# Altium schematic sheet верхняя плата версия 1.SchDoc
size A2; SheetNumber: 1; SheetTotal: 1
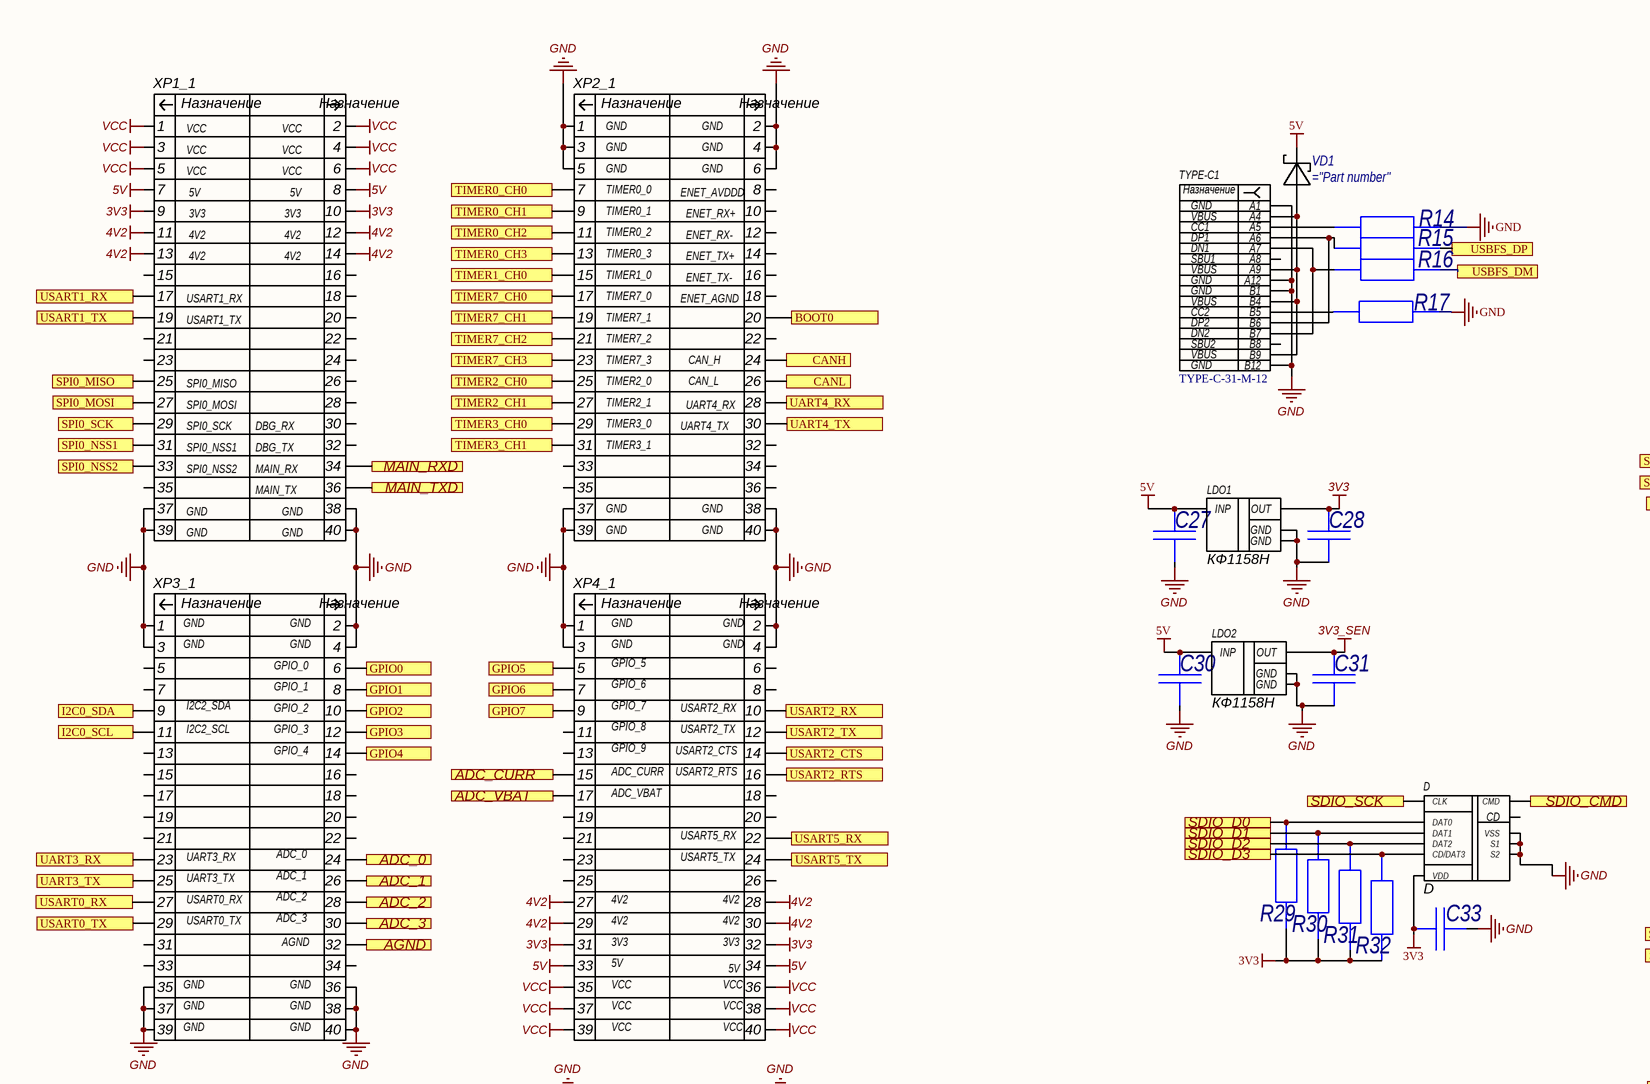
[diagram p0: верхняя плата версия 1.SchDoc, top left]
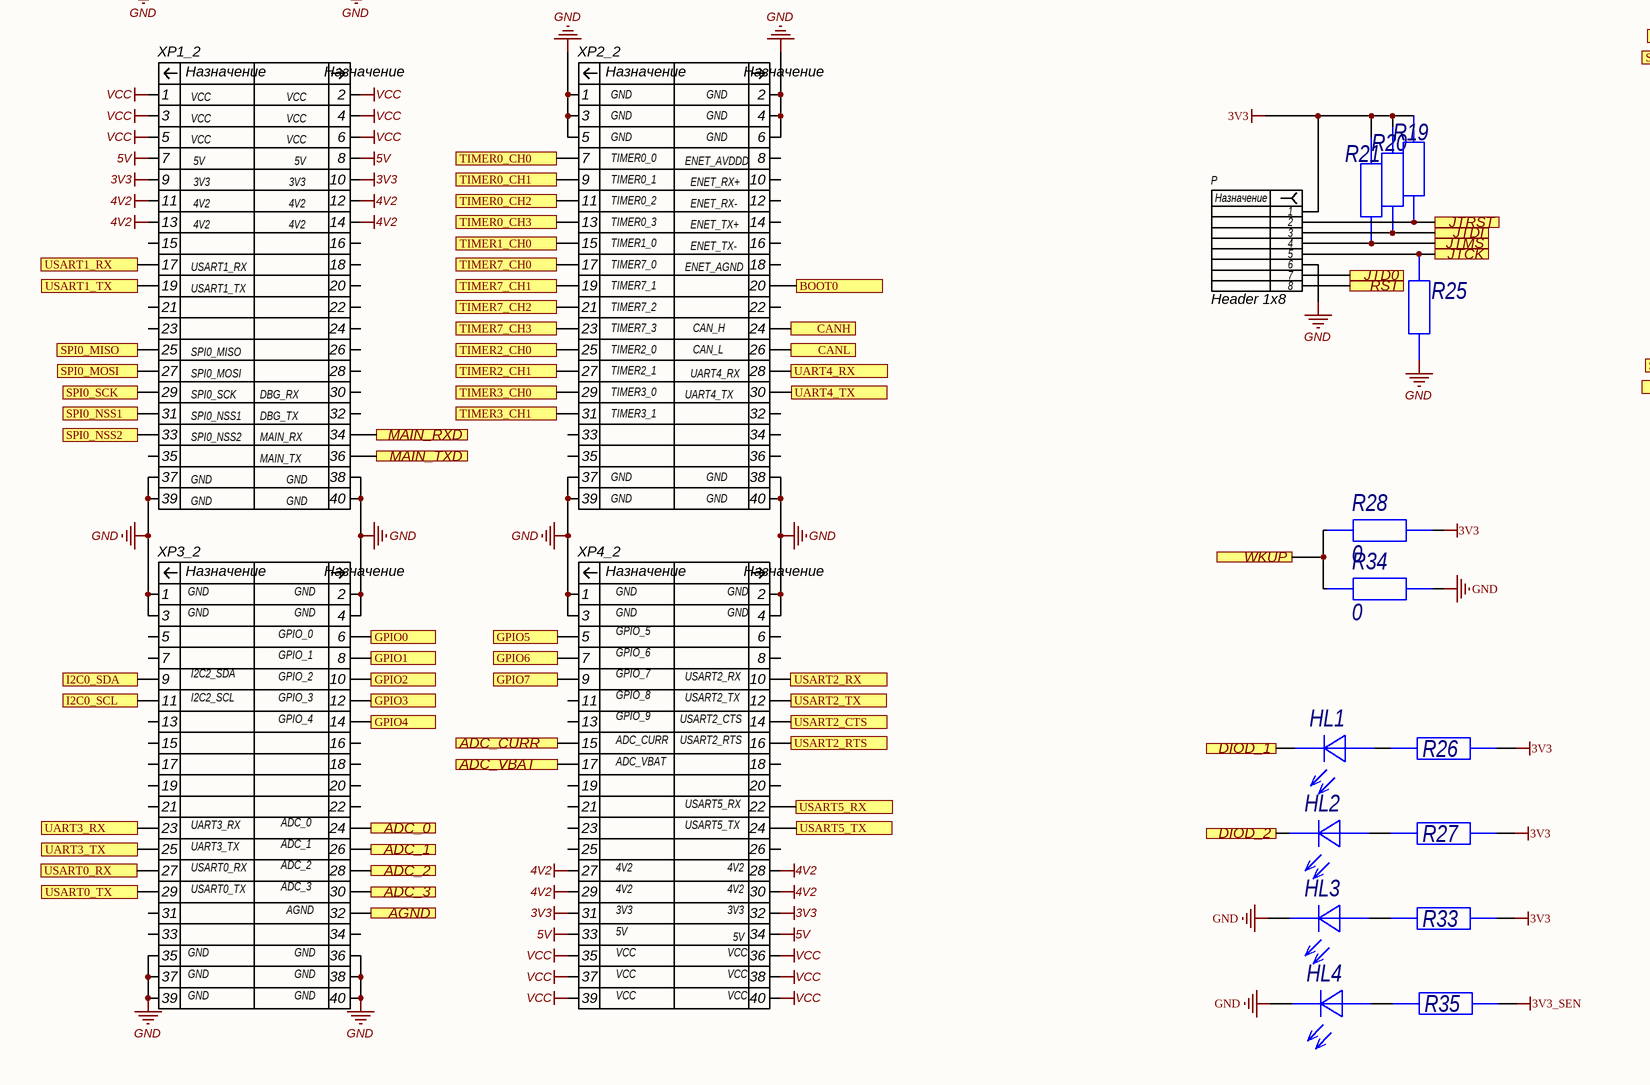
[diagram p1: верхняя плата версия 1.SchDoc, bottom left]
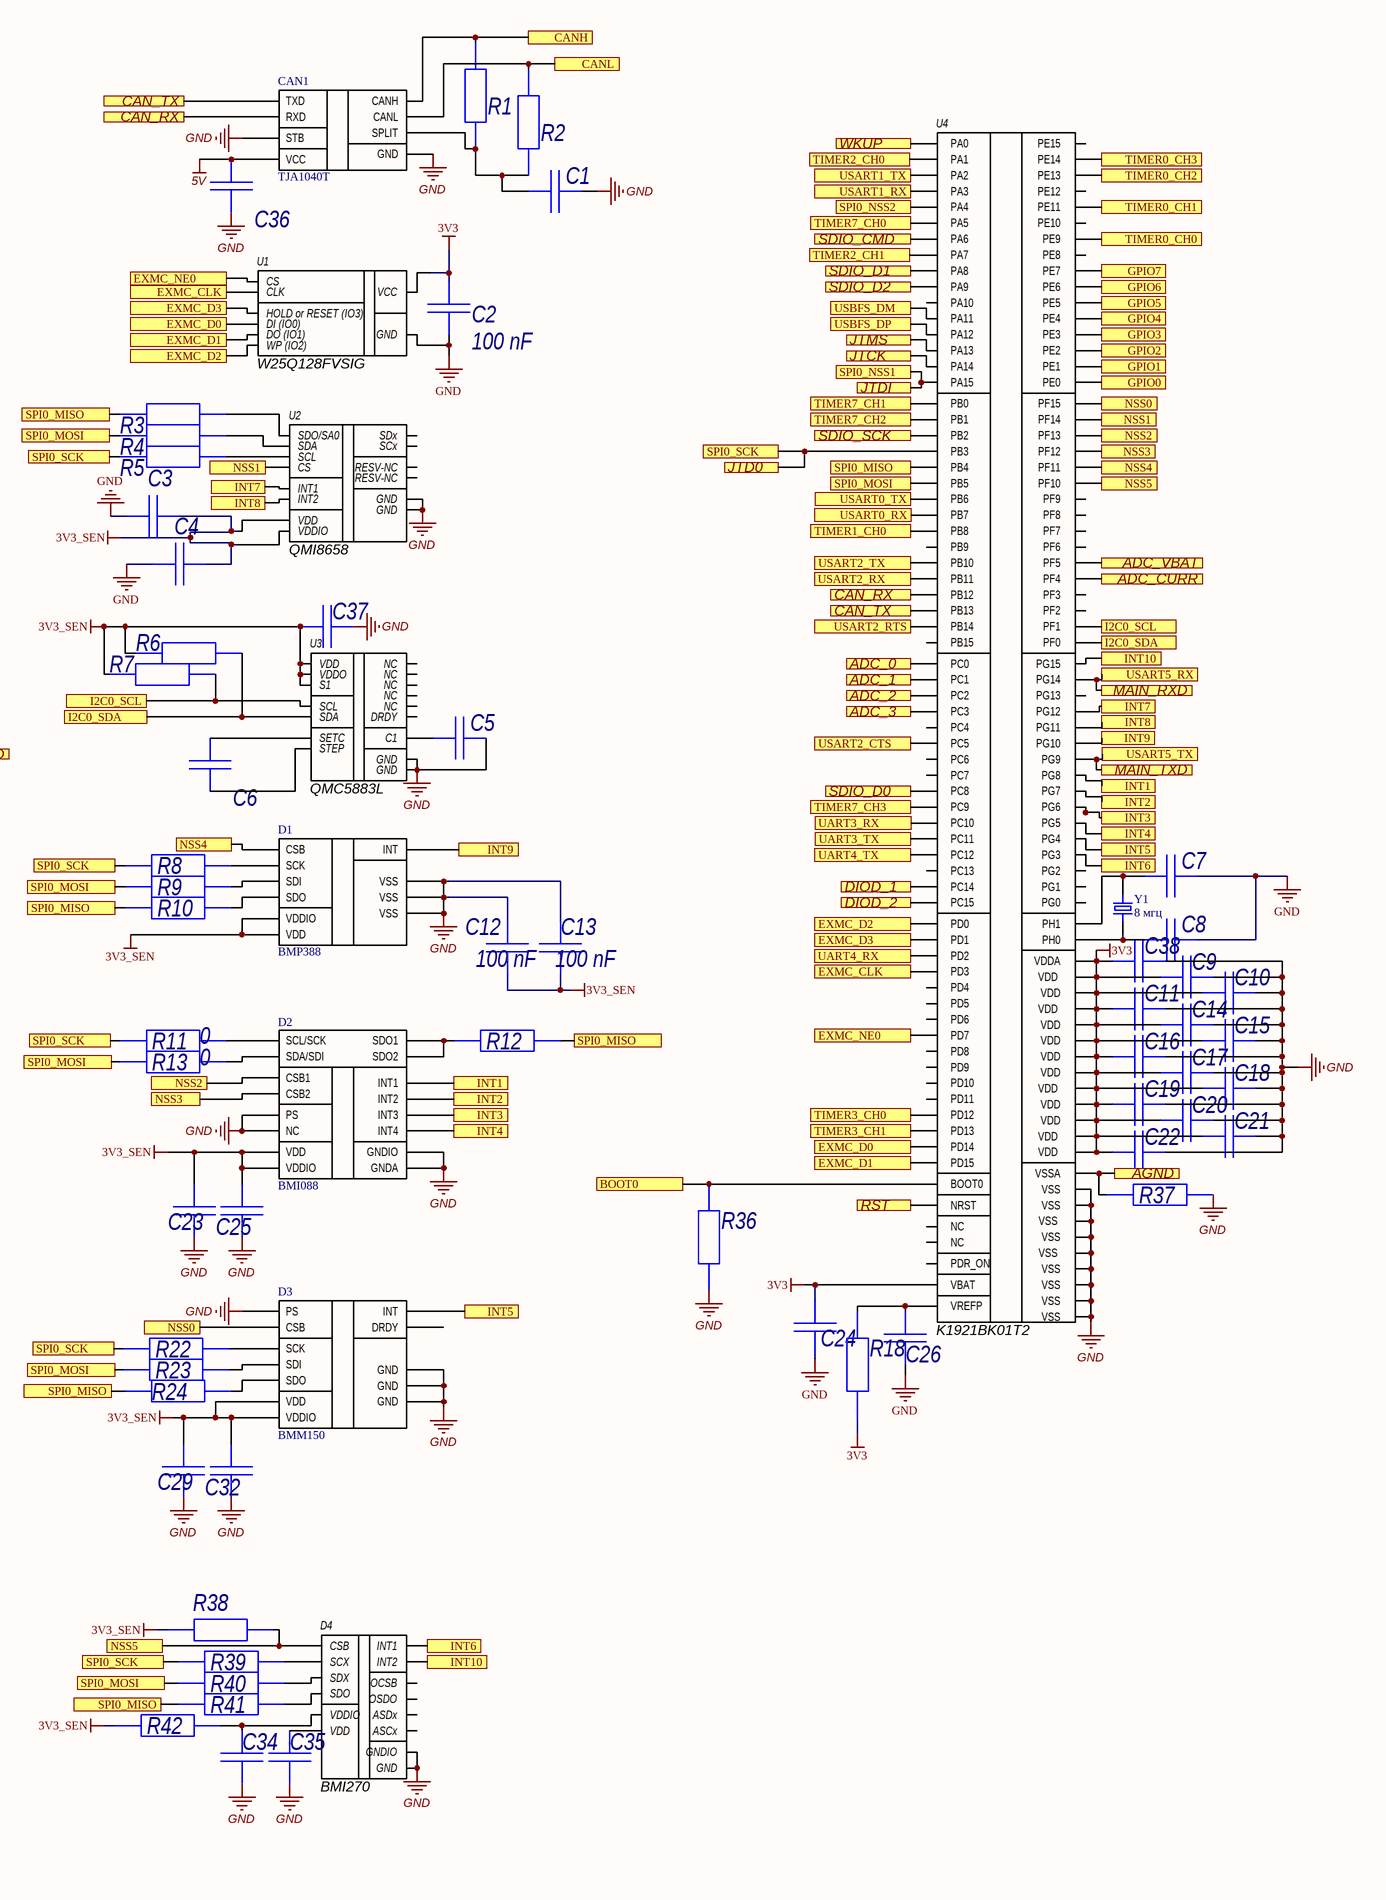
[diagram p2: верхняя плата версия 1.SchDoc, bottom right]

## Parts
C1  47 nF  [C0603]  (value not drawn)
C2  100 nF  [C0603]
C3  100 nF  [C0603]  (value not drawn)
C4  100 nF  [C0603]  (value not drawn)
C5  4.7 uF  [C0603]  (value not drawn)
C6  0.22 uF  [C0603]  (value not drawn)
C7  22 pF  [C0603]  (value not drawn)
C8  22 pF  [C0603]  (value not drawn)
C9  100 nF  [C0603]  (value not drawn)
C10  100 nF  [C0603]  (value not drawn)
C11  100 nF  [C0603]  (value not drawn)
C12  100 nF  [C0603]
C13  100 nF  [C0603]
C14  100 nF  [C0603]  (value not drawn)
C15  100 nF  [C0603]  (value not drawn)
C16  100 nF  [C0603]  (value not drawn)
C17  100 nF  [C0603]  (value not drawn)
C18  100 nF  [C0603]  (value not drawn)
C19  100 nF  [C0603]  (value not drawn)
C20  100 nF  [C0603]  (value not drawn)
C21  100 nF  [C0603]  (value not drawn)
C22  100 nF  [C0603]  (value not drawn)
C23  100 nF  [C0603]  (value not drawn)
C24  100 nF  [C0603]  (value not drawn)
C25  100 nF  [C0603]  (value not drawn)
C26  100 nF  [C0603]  (value not drawn)
C27  0.1 uF  [C0603]  (value not drawn)
C28  10 uF  [C0603]  (value not drawn)
C29  100 nF  [C0603]  (value not drawn)
C30  0.1 uF  [C0603]  (value not drawn)
C31  10 uF  [C0603]  (value not drawn)
C32  100 nF  [C0603]  (value not drawn)
C33  0.1 uF  [C0603]  (value not drawn)
C34  100 nF  [C0603]  (value not drawn)
C35  100 nF  [C0603]  (value not drawn)
C36  100 nF  [C0603]  (value not drawn)
C37  100 nF  [C0603]  (value not drawn)
C38  100 nF  [C0603]  (value not drawn)
CAN1  TJA1040T  [SO-8_S]
D  D  [GTFP08131Y2HR]
D1  BMP388  [PQFN50P200X200X80-10N]
D2  BMI088  [PQFN50P450X300X100-16N]
D3  BMM150  [XDCR_BMM150]
D4  BMI270  [XDCR_BMI270]
HL1  (no value)  [LD0805]
HL2  (no value)  [LD0805]
HL3  (no value)  [LD0805]
HL4  (no value)  [LD0805]
LDO1  КФ1158Н  [ТО-263]
LDO2  КФ1158Н  [ТО-263]
P  Header 1x8  [PicoBlade 8pin]
R1  60Om  [R0603]  (value not drawn)
R2  60 Om  [R0603]  (value not drawn)
R3  0  [R0603]  (value not drawn)
R4  0  [R0603]  (value not drawn)
R5  0  [R0603]  (value not drawn)
R6  2.2k  [R0603]  (value not drawn)
R7  2.2k  [R0603]  (value not drawn)
R8  0  [R0603]  (value not drawn)
R9  0  [R0603]  (value not drawn)
R10  0  [R0603]  (value not drawn)
R11  0  [R0603]
R12  0  [R0603]  (value not drawn)
R13  0  [R0603]
R14  5,1 кОм  [R0603]  (value not drawn)
R15  68  [R0603]  (value not drawn)
R16  68  [R0603]  (value not drawn)
R17  5,1 кОм  [R0603]  (value not drawn)
R18  47 Ом  [R0603]  (value not drawn)
R19  47 кОм  [R0603]  (value not drawn)
R20  47 кОм  [R0603]  (value not drawn)
R21  47 кОм  [R0603]  (value not drawn)
R22  0  [R0603]  (value not drawn)
R23  0  [R0603]  (value not drawn)
R24  0  [R0603]  (value not drawn)
R25  47 кОм  [R0603]  (value not drawn)
R26  220  [R0603]  (value not drawn)
R27  220  [R0603]  (value not drawn)
R28  0  [R0603]
R29  47 кОм  [R0603]  (value not drawn)
R30  47 кОм  [R0603]  (value not drawn)
R31  47 кОм  [R0603]  (value not drawn)
R32  47 кОм  [R0603]  (value not drawn)
R33  220  [R0603]  (value not drawn)
R34  0  [R0603]
R35  220  [R0603]  (value not drawn)
R36  10 kOm  [R0603]  (value not drawn)
R37  0  [R0603]  (value not drawn)
R38  10 кОм  [R0603]  (value not drawn)
R39  0  [R0603]  (value not drawn)
R40  0  [R0603]  (value not drawn)
R41  0  [R0603]  (value not drawn)
R42  0  [R0603]  (value not drawn)
TYPE-C1  TYPE-C-31-M-12  [HRO_TYPE-C-31-M-12]
U1  W25Q128FVSIG  [SOIC127P790X216-8N]
U2  QMI8658  [QMI8658]
U3  QMC5883L  [QMC5883L]
U4  K1921BK01T2  [QFP50P2200X2200X160-144N]
VD1  (no value)  [DO-214AA]
XP1_1  PLLD-1.27-40S  [Headr 2x20 male]  (value not drawn)
XP1_2  PLLD-1.27-40S  [Headr 2x20 Female]  (value not drawn)
XP2_1  PLLD-1.27-40S  [Headr 2x20 male]  (value not drawn)
XP2_2  PLLD-1.27-40S  [Headr 2x20 Female]  (value not drawn)
XP3_1  PLLD-1.27-40S  [Headr 2x20 male]  (value not drawn)
XP3_2  PLLD-1.27-40S  [Headr 2x20 Female]  (value not drawn)
XP4_1  PLLD-1.27-40S  [Headr 2x20 male]  (value not drawn)
XP4_2  PLLD-1.27-40S  [Headr 2x20 Female]  (value not drawn)
Y1  8 мгц  [XTAL_ABM7-8.000MHZ-8-R80-D2Y-T]

## Ports
ADC_0 (see верхняя плата версия 1[2B], верхняя плата версия 1[2D]), ADC_0 (see верхняя плата версия 1[2B], верхняя плата версия 1[7B]), ADC_0 (see верхняя плата версия 1[2D], верхняя плата версия 1[7B]), ADC_1 (see верхняя плата версия 1[2B], верхняя плата версия 1[2D]), ADC_1 (see верхняя плата версия 1[2B], верхняя плата версия 1[7B]), ADC_1 (see верхняя плата версия 1[2D], верхняя плата версия 1[7B]), ADC_2 (see верхняя плата версия 1[2B], верхняя плата версия 1[2D]), ADC_2 (see верхняя плата версия 1[2B], верхняя плата версия 1[7B]), ADC_2 (see верхняя плата версия 1[2D], верхняя плата версия 1[7B]), ADC_3 (see верхняя плата версия 1[2B], верхняя плата версия 1[2D]), ADC_3 (see верхняя плата версия 1[2B], верхняя плата версия 1[7B]), ADC_3 (see верхняя плата версия 1[2D], верхняя плата версия 1[7B]), ADC_CURR (see верхняя плата версия 1[2B], верхняя плата версия 1[2D]), ADC_CURR (see верхняя плата версия 1[2B], верхняя плата версия 1[8B]), ADC_CURR (see верхняя плата версия 1[2D], верхняя плата версия 1[8B]), ADC_VBAT (see верхняя плата версия 1[2B], верхняя плата версия 1[2D]), ADC_VBAT (see верхняя плата версия 1[2B], верхняя плата версия 1[8B]), ADC_VBAT (see верхняя плата версия 1[2D], верхняя плата версия 1[8B]), AGND (see верхняя плата версия 1[2B], верхняя плата версия 1[2D]), AGND (see верхняя плата версия 1[2B], верхняя плата версия 1[8C]), AGND (see верхняя плата версия 1[2D], верхняя плата версия 1[8C]), BOOT0 (see верхняя плата версия 1[3A], верхняя плата версия 1[3C]), BOOT0 (see верхняя плата версия 1[3A], верхняя плата версия 1[6C]), BOOT0 (see верхняя плата версия 1[3C], верхняя плата версия 1[6C]), CAN_RX (see верхняя плата версия 1[5A]), CAN_RX (see верхняя плата версия 1[7B]), CAN_TX (see верхняя плата версия 1[5A]), CAN_TX (see верхняя плата версия 1[7B]), CANH (see верхняя плата версия 1[3A], верхняя плата версия 1[3C]), CANH (see верхняя плата версия 1[3A], верхняя плата версия 1[6A]), CANH (see верхняя плата версия 1[3C], верхняя плата версия 1[6A]), CANL (see верхняя плата версия 1[3A], верхняя плата версия 1[3C]), CANL (see верхняя плата версия 1[3A], верхняя плата версия 1[6A]), CANL (see верхняя плата версия 1[3C], верхняя плата версия 1[6A]), DIOD_1 (see верхняя плата версия 1[4D]), DIOD_1 (see верхняя плата версия 1[7B]), DIOD_2 (see верхняя плата версия 1[4D]), DIOD_2 (see верхняя плата версия 1[7B]), EXMC_CLK (see верхняя плата версия 1[5A]), EXMC_CLK (see верхняя плата версия 1[7B]), EXMC_D0 (see верхняя плата версия 1[5A]), EXMC_D0 (see верхняя плата версия 1[7C]), EXMC_D1 (see верхняя плата версия 1[5A]), EXMC_D1 (see верхняя плата версия 1[7C]), EXMC_D2 (see верхняя плата версия 1[5A]), EXMC_D2 (see верхняя плата версия 1[7B]), EXMC_D3 (see верхняя плата версия 1[5A]), EXMC_D3 (see верхняя плата версия 1[7B]), EXMC_NE0 (see верхняя плата версия 1[5A]), EXMC_NE0 (see верхняя плата версия 1[7B]), GPIO0 (see верхняя плата версия 1[2B], верхняя плата версия 1[2D]), GPIO0 (see верхняя плата версия 1[2B], верхняя плата версия 1[8A]), GPIO0 (see верхняя плата версия 1[2D], верхняя плата версия 1[8A]), GPIO1 (see верхняя плата версия 1[2B], верхняя плата версия 1[2D]), GPIO1 (see верхняя плата версия 1[2B], верхняя плата версия 1[8A]), GPIO1 (see верхняя плата версия 1[2D], верхняя плата версия 1[8A]), GPIO2 (see верхняя плата версия 1[2B], верхняя плата версия 1[2D]), GPIO2 (see верхняя плата версия 1[2B], верхняя плата версия 1[8A]), GPIO2 (see верхняя плата версия 1[2D], верхняя плата версия 1[8A]), GPIO3 (see верхняя плата версия 1[2B], верхняя плата версия 1[2D]), GPIO3 (see верхняя плата версия 1[2B], верхняя плата версия 1[8A]), GPIO3 (see верхняя плата версия 1[2D], верхняя плата версия 1[8A]), GPIO4 (see верхняя плата версия 1[2B], верхняя плата версия 1[2D]), GPIO4 (see верхняя плата версия 1[2B], верхняя плата версия 1[8A]), GPIO4 (see верхняя плата версия 1[2D], верхняя плата версия 1[8A]), GPIO5 (see верхняя плата версия 1[2B], верхняя плата версия 1[2D]), GPIO5 (see верхняя плата версия 1[2B], верхняя плата версия 1[8A]), GPIO5 (see верхняя плата версия 1[2D], верхняя плата версия 1[8A]), GPIO6 (see верхняя плата версия 1[2B], верхняя плата версия 1[2D]), GPIO6 (see верхняя плата версия 1[2B], верхняя плата версия 1[8A]), GPIO6 (see верхняя плата версия 1[2D], верхняя плата версия 1[8A]), GPIO7 (see верхняя плата версия 1[2B], верхняя плата версия 1[2D]), GPIO7 (see верхняя плата версия 1[2B], верхняя плата версия 1[8A]), GPIO7 (see верхняя плата версия 1[2D], верхняя плата версия 1[8A]), I2C0_SCL (see верхняя плата версия 1[1B], верхняя плата версия 1[1D], верхняя плата версия 1[5B]), I2C0_SCL (see верхняя плата версия 1[1B], верхняя плата версия 1[1D], верхняя плата версия 1[8B]), I2C0_SCL (see верхняя плата версия 1[1B], верхняя плата версия 1[5B], верхняя плата версия 1[8B]), I2C0_SCL (see верхняя плата версия 1[1D], верхняя плата версия 1[5B], верхняя плата версия 1[8B]), I2C0_SDA (see верхняя плата версия 1[1B], верхняя плата версия 1[1D], верхняя плата версия 1[5B]), I2C0_SDA (see верхняя плата версия 1[1B], верхняя плата версия 1[1D], верхняя плата версия 1[8B]), I2C0_SDA (see верхняя плата версия 1[1B], верхняя плата версия 1[5B], верхняя плата версия 1[8B]), I2C0_SDA (see верхняя плата версия 1[1D], верхняя плата версия 1[5B], верхняя плата версия 1[8B]), INT1 (see верхняя плата версия 1[6C]), INT1 (see верхняя плата версия 1[8B]), INT2 (see верхняя плата версия 1[6C]), INT2 (see верхняя плата версия 1[8B]), INT3 (see верхняя плата версия 1[6C]), INT3 (see верхняя плата версия 1[8B]), INT4 (see верхняя плата версия 1[6C]), INT4 (see верхняя плата версия 1[8B]), INT5 (see верхняя плата версия 1[6C]), INT5 (see верхняя плата версия 1[8B]), INT6 (see верхняя плата версия 1[6D]), INT6 (see верхняя плата версия 1[8B]), INT7 (see верхняя плата версия 1[5A]), INT7 (see верхняя плата версия 1[8B]), INT8 (see верхняя плата версия 1[5A]), INT8 (see верхняя плата версия 1[8B]), INT9 (see верхняя плата версия 1[6B]), INT9 (see верхняя плата версия 1[8B]), INT10 (see верхняя плата версия 1[6D]), INT10 (see верхняя плата версия 1[8B]), JTCK (see верхняя плата версия 1[4C]), JTCK (see верхняя плата версия 1[7A]), JTD0 (see верхняя плата версия 1[4C]), JTD0 (see верхняя плата версия 1[7A]), JTDI (see верхняя плата версия 1[4C]), JTDI (see верхняя плата версия 1[7A]), JTMS (see верхняя плата версия 1[4C]), JTMS (see верхняя плата версия 1[7A]), JTRST, MAIN_RXD (see верхняя плата версия 1[2A], верхняя плата версия 1[2C]), MAIN_RXD (see верхняя плата версия 1[2A], верхняя плата версия 1[8B]), MAIN_RXD (see верхняя плата версия 1[2C], верхняя плата версия 1[8B]), MAIN_TXD (see верхняя плата версия 1[2A], верхняя плата версия 1[2C]), MAIN_TXD (see верхняя плата версия 1[2A], верхняя плата версия 1[8B]), MAIN_TXD (see верхняя плата версия 1[2C], верхняя плата версия 1[8B]), NSS0 (see верхняя плата версия 1[5C]), NSS0 (see верхняя плата версия 1[8A]), NSS1 (see верхняя плата версия 1[5A]), NSS1 (see верхняя плата версия 1[8A]), NSS2 (see верхняя плата версия 1[5C]), NSS2 (see верхняя плата версия 1[8A]), NSS3 (see верхняя плата версия 1[5C]), NSS3 (see верхняя плата версия 1[8A]), NSS4 (see верхняя плата версия 1[5B]), NSS4 (see верхняя плата версия 1[8A]), NSS5 (see верхняя плата версия 1[5D]), NSS5 (see верхняя плата версия 1[8A]), RST (see верхняя плата версия 1[4C]), RST (see верхняя плата версия 1[7C]), SDIO_CMD (see верхняя плата версия 1[5B]), SDIO_CMD (see верхняя плата версия 1[7A]), SDIO_D0 (see верхняя плата версия 1[4B]), SDIO_D0 (see верхняя плата версия 1[7B]), SDIO_D1 (see верхняя плата версия 1[4B]), SDIO_D1 (see верхняя плата версия 1[7A]), SDIO_D2 (see верхняя плата версия 1[4B]), SDIO_D2 (see верхняя плата версия 1[7A]), SDIO_D3, SDIO_SCK (see верхняя плата версия 1[4B]), SDIO_SCK (see верхняя плата версия 1[7A]), SPI0_MISO (see верхняя плата версия 1[1A], верхняя плата версия 1[1C], верхняя плата версия 1[5A], верхняя плата версия 1[5B], верхняя плата версия 1[5C], верхняя плата версия 1[5D], верхняя плата версия 1[6C]), SPI0_MISO (see верхняя плата версия 1[1A], верхняя плата версия 1[1C], верхняя плата версия 1[5A], верхняя плата версия 1[5B], верхняя плата версия 1[5C], верхняя плата версия 1[5D], верхняя плата версия 1[7A]), SPI0_MISO (see верхняя плата версия 1[1A], верхняя плата версия 1[1C], верхняя плата версия 1[5A], верхняя плата версия 1[5B], верхняя плата версия 1[5C], верхняя плата версия 1[6C], верхняя плата версия 1[7A]), SPI0_MISO (see верхняя плата версия 1[1A], верхняя плата версия 1[1C], верхняя плата версия 1[5A], верхняя плата версия 1[5B], верхняя плата версия 1[5D], верхняя плата версия 1[6C], верхняя плата версия 1[7A]), SPI0_MISO (see верхняя плата версия 1[1A], верхняя плата версия 1[1C], верхняя плата версия 1[5A], верхняя плата версия 1[5C], верхняя плата версия 1[5D], верхняя плата версия 1[6C], верхняя плата версия 1[7A]), SPI0_MISO (see верхняя плата версия 1[1A], верхняя плата версия 1[1C], верхняя плата версия 1[5B], верхняя плата версия 1[5C], верхняя плата версия 1[5D], верхняя плата версия 1[6C], верхняя плата версия 1[7A]), SPI0_MISO (see верхняя плата версия 1[1A], верхняя плата версия 1[5A], верхняя плата версия 1[5B], верхняя плата версия 1[5C], верхняя плата версия 1[5D], верхняя плата версия 1[6C], верхняя плата версия 1[7A]), SPI0_MISO (see верхняя плата версия 1[1C], верхняя плата версия 1[5A], верхняя плата версия 1[5B], верхняя плата версия 1[5C], верхняя плата версия 1[5D], верхняя плата версия 1[6C], верхняя плата версия 1[7A]), SPI0_MOSI (see верхняя плата версия 1[1A], верхняя плата версия 1[1C], верхняя плата версия 1[5A], верхняя плата версия 1[5B], верхняя плата версия 1[5C], верхняя плата версия 1[5D]), SPI0_MOSI (see верхняя плата версия 1[1A], верхняя плата версия 1[1C], верхняя плата версия 1[5A], верхняя плата версия 1[5B], верхняя плата версия 1[5C], верхняя плата версия 1[5D], верхняя плата версия 1[7A]), SPI0_MOSI (see верхняя плата версия 1[1A], верхняя плата версия 1[1C], верхняя плата версия 1[5A], верхняя плата версия 1[5B], верхняя плата версия 1[5C], верхняя плата версия 1[7A]), SPI0_MOSI (see верхняя плата версия 1[1A], верхняя плата версия 1[1C], верхняя плата версия 1[5A], верхняя плата версия 1[5C], верхняя плата версия 1[5D], верхняя плата версия 1[7A]), SPI0_MOSI (see верхняя плата версия 1[1A], верхняя плата версия 1[1C], верхняя плата версия 1[5B], верхняя плата версия 1[5C], верхняя плата версия 1[5D], верхняя плата версия 1[7A]), SPI0_MOSI (see верхняя плата версия 1[1A], верхняя плата версия 1[5A], верхняя плата версия 1[5B], верхняя плата версия 1[5C], верхняя плата версия 1[5D], верхняя плата версия 1[7A]), SPI0_MOSI (see верхняя плата версия 1[1C], верхняя плата версия 1[5A], верхняя плата версия 1[5B], верхняя плата версия 1[5C], верхняя плата версия 1[5D], верхняя плата версия 1[7A]), SPI0_NSS1 (see верхняя плата версия 1[1A], верхняя плата версия 1[1C]), SPI0_NSS1 (see верхняя плата версия 1[1A], верхняя плата версия 1[7A]), SPI0_NSS1 (see верхняя плата версия 1[1C], верхняя плата версия 1[7A]), SPI0_NSS2 (see верхняя плата версия 1[1A], верхняя плата версия 1[1C]), SPI0_NSS2 (see верхняя плата версия 1[1A], верхняя плата версия 1[7A]), SPI0_NSS2 (see верхняя плата версия 1[1C], верхняя плата версия 1[7A]), SPI0_SCK (see верхняя плата версия 1[1A], верхняя плата версия 1[1C], верхняя плата версия 1[5A], верхняя плата версия 1[5B], верхняя плата версия 1[5C], верхняя плата версия 1[5D]), SPI0_SCK (see верхняя плата версия 1[1A], верхняя плата версия 1[1C], верхняя плата версия 1[5A], верхняя плата версия 1[5B], верхняя плата версия 1[5C], верхняя плата версия 1[5D], верхняя плата версия 1[7A]), SPI0_SCK (see верхняя плата версия 1[1A], верхняя плата версия 1[1C], верхняя плата версия 1[5A], верхняя плата версия 1[5B], верхняя плата версия 1[5C], верхняя плата версия 1[7A]), SPI0_SCK (see верхняя плата версия 1[1A], верхняя плата версия 1[1C], верхняя плата версия 1[5A], верхняя плата версия 1[5C], верхняя плата версия 1[5D], верхняя плата версия 1[7A]), SPI0_SCK (see верхняя плата версия 1[1A], верхняя плата версия 1[1C], верхняя плата версия 1[5B], верхняя плата версия 1[5C], верхняя плата версия 1[5D], верхняя плата версия 1[7A]), SPI0_SCK (see верхняя плата версия 1[1A], верхняя плата версия 1[5A], верхняя плата версия 1[5B], верхняя плата версия 1[5C], верхняя плата версия 1[5D], верхняя плата версия 1[7A]), SPI0_SCK (see верхняя плата версия 1[1C], верхняя плата версия 1[5A], верхняя плата версия 1[5B], верхняя плата версия 1[5C], верхняя плата версия 1[5D], верхняя плата версия 1[7A]), TIMER0_CH0 (see верхняя плата версия 1[2A], верхняя плата версия 1[2C]), TIMER0_CH0 (see верхняя плата версия 1[2A], верхняя плата версия 1[8A]), TIMER0_CH0 (see верхняя плата версия 1[2C], верхняя плата версия 1[8A]), TIMER0_CH1 (see верхняя плата версия 1[2A], верхняя плата версия 1[2C]), TIMER0_CH1 (see верхняя плата версия 1[2A], верхняя плата версия 1[8A]), TIMER0_CH1 (see верхняя плата версия 1[2C], верхняя плата версия 1[8A]), TIMER0_CH2 (see верхняя плата версия 1[2A], верхняя плата версия 1[2C]), TIMER0_CH2 (see верхняя плата версия 1[2A], верхняя плата версия 1[8A]), TIMER0_CH2 (see верхняя плата версия 1[2C], верхняя плата версия 1[8A]), TIMER0_CH3 (see верхняя плата версия 1[2A], верхняя плата версия 1[2C]), TIMER0_CH3 (see верхняя плата версия 1[2A], верхняя плата версия 1[8A]), TIMER0_CH3 (see верхняя плата версия 1[2C], верхняя плата версия 1[8A]), TIMER1_CH0 (see верхняя плата версия 1[2A], верхняя плата версия 1[2C]), TIMER1_CH0 (see верхняя плата версия 1[2A], верхняя плата версия 1[7B]), TIMER1_CH0 (see верхняя плата версия 1[2C], верхняя плата версия 1[7B]), TIMER2_CH0 (see верхняя плата версия 1[2A], верхняя плата версия 1[2C]), TIMER2_CH0 (see верхняя плата версия 1[2A], верхняя плата версия 1[7A]), TIMER2_CH0 (see верхняя плата версия 1[2C], верхняя плата версия 1[7A]), TIMER2_CH1 (see верхняя плата версия 1[2A], верхняя плата версия 1[2C]), TIMER2_CH1 (see верхняя плата версия 1[2A], верхняя плата версия 1[7A]), TIMER2_CH1 (see верхняя плата версия 1[2C], верхняя плата версия 1[7A]), TIMER3_CH0 (see верхняя плата версия 1[2A], верхняя плата версия 1[2C]), TIMER3_CH0 (see верхняя плата версия 1[2A], верхняя плата версия 1[7C]), TIMER3_CH0 (see верхняя плата версия 1[2C], верхняя плата версия 1[7C]), TIMER3_CH1 (see верхняя плата версия 1[2A], верхняя плата версия 1[2C]), TIMER3_CH1 (see верхняя плата версия 1[2A], верхняя плата версия 1[7C]), TIMER3_CH1 (see верхняя плата версия 1[2C], верхняя плата версия 1[7C]), TIMER7_CH0 (see верхняя плата версия 1[2A], верхняя плата версия 1[2C]), TIMER7_CH0 (see верхняя плата версия 1[2A], верхняя плата версия 1[7A]), TIMER7_CH0 (see верхняя плата версия 1[2C], верхняя плата версия 1[7A]), TIMER7_CH1 (see верхняя плата версия 1[2A], верхняя плата версия 1[2C]), TIMER7_CH1 (see верхняя плата версия 1[2A], верхняя плата версия 1[7A]), TIMER7_CH1 (see верхняя плата версия 1[2C], верхняя плата версия 1[7A]), TIMER7_CH2 (see верхняя плата версия 1[2A], верхняя плата версия 1[2C]), TIMER7_CH2 (see верхняя плата версия 1[2A], верхняя плата версия 1[7A]), TIMER7_CH2 (see верхняя плата версия 1[2C], верхняя плата версия 1[7A]), TIMER7_CH3 (see верхняя плата версия 1[2A], верхняя плата версия 1[2C]), TIMER7_CH3 (see верхняя плата версия 1[2A], верхняя плата версия 1[7B]), TIMER7_CH3 (see верхняя плата версия 1[2C], верхняя плата версия 1[7B]), UART3_RX (see верхняя плата версия 1[1B], верхняя плата версия 1[1D]), UART3_RX (see верхняя плата версия 1[1B], верхняя плата версия 1[7B]), UART3_RX (see верхняя плата версия 1[1D], верхняя плата версия 1[7B]), UART3_TX (see верхняя плата версия 1[1B], верхняя плата версия 1[1D]), UART3_TX (see верхняя плата версия 1[1B], верхняя плата версия 1[7B]), UART3_TX (see верхняя плата версия 1[1D], верхняя плата версия 1[7B]), UART4_RX (see верхняя плата версия 1[3A], верхняя плата версия 1[3C]), UART4_RX (see верхняя плата версия 1[3A], верхняя плата версия 1[7B]), UART4_RX (see верхняя плата версия 1[3C], верхняя плата версия 1[7B]), UART4_TX (see верхняя плата версия 1[3A], верхняя плата версия 1[3C]), UART4_TX (see верхняя плата версия 1[3A], верхняя плата версия 1[7B]), UART4_TX (see верхняя плата версия 1[3C], верхняя плата версия 1[7B]), USART0_RX (see верхняя плата версия 1[1B], верхняя плата версия 1[1D]), USART0_RX (see верхняя плата версия 1[1B], верхняя плата версия 1[7B]), USART0_RX (see верхняя плата версия 1[1D], верхняя плата версия 1[7B]), USART0_TX (see верхняя плата версия 1[1B], верхняя плата версия 1[1D]), USART0_TX (see верхняя плата версия 1[1B], верхняя плата версия 1[7A]), USART0_TX (see верхняя плата версия 1[1D], верхняя плата версия 1[7A]), USART1_RX (see верхняя плата версия 1[1A], верхняя плата версия 1[1C]), USART1_RX (see верхняя плата версия 1[1A], верхняя плата версия 1[7A]), USART1_RX (see верхняя плата версия 1[1C], верхняя плата версия 1[7A]), USART1_TX (see верхняя плата версия 1[1A], верхняя плата версия 1[1C]), USART1_TX (see верхняя плата версия 1[1A], верхняя плата версия 1[7A]), USART1_TX (see верхняя плата версия 1[1C], верхняя плата версия 1[7A]), USART2_CTS (see верхняя плата версия 1[3B], верхняя плата версия 1[3D]), USART2_CTS (see верхняя плата версия 1[3B], верхняя плата версия 1[7B]), USART2_CTS (see верхняя плата версия 1[3D], верхняя плата версия 1[7B]), USART2_RTS (see верхняя плата версия 1[3B], верхняя плата версия 1[3D]), USART2_RTS (see верхняя плата версия 1[3B], верхняя плата версия 1[7B]), USART2_RTS (see верхняя плата версия 1[3D], верхняя плата версия 1[7B]), USART2_RX (see верхняя плата версия 1[3B], верхняя плата версия 1[3D]), USART2_RX (see верхняя плата версия 1[3B], верхняя плата версия 1[7B]), USART2_RX (see верхняя плата версия 1[3D], верхняя плата версия 1[7B]), USART2_TX (see верхняя плата версия 1[3B], верхняя плата версия 1[3D]), USART2_TX (see верхняя плата версия 1[3B], верхняя плата версия 1[7B]), USART2_TX (see верхняя плата версия 1[3D], верхняя плата версия 1[7B]), USART5_RX (see верхняя плата версия 1[3B], верхняя плата версия 1[3D]), USART5_RX (see верхняя плата версия 1[3B], верхняя плата версия 1[8B]), USART5_RX (see верхняя плата версия 1[3D], верхняя плата версия 1[8B]), USART5_TX (see верхняя плата версия 1[3B], верхняя плата версия 1[3D]), USART5_TX (see верхняя плата версия 1[3B], верхняя плата версия 1[8B]), USART5_TX (see верхняя плата версия 1[3D], верхняя плата версия 1[8B]), USBFS_DM (see верхняя плата версия 1[4A]), USBFS_DM (see верхняя плата версия 1[7A]), USBFS_DP (see верхняя плата версия 1[4A]), USBFS_DP (see верхняя плата версия 1[7A]), WKUP (see верхняя плата версия 1[4C]), WKUP (see верхняя плата версия 1[7A])

## Nets
3V3: C2.2 C9.2 C10.2 C11.2 C14.2 C15.2 C16.2 C17.2 C18.2 C19.2 C20.2 C21.2 C22.2 C24.2 C28.2 C33.2 C38.2 D.4(VDD) LDO1.3(OUT) P.1 R18.1 R19.2 R20.2 R21.2 R26.2 R27.2 R28.2 R29.1 R30.1 R31.1 R32.1 R33.2 U1.8(VCC) U4.6(VBAT) U4.17(VDD) U4.30(VDD) U4.33(VDDA) U4.39(VDD) U4.52(VDD) U4.62(VDD) U4.72(VDD) U4.84(VDD) U4.95(VDD) U4.108(VDD) U4.121(VDD) U4.131(VDD) U4.144(VDD) XP1_1.9 XP1_1.10 XP1_2.9 XP1_2.10 XP4_1.31 XP4_1.32 XP4_2.31 XP4_2.32
3V3_SEN: C3.2 C4.2 C12.2 C13.2 C23.2 C25.2 C29.2 C31.2 C32.2 C37.2 D1.1(VDDIO) D1.10(VDD) D2.3(VDD) D2.11(VDDIO) D3.B2(VDDIO) D3.E5(VDD) LDO2.3(OUT) R6.2 R7.2 R35.2 R38.2 R42.2 U2.5(VDDIO) U2.8(VDD) U3.2(VDD) U3.4(S1) U3.13(VDDO)
4V2: XP1_1.11 XP1_1.12 XP1_1.13 XP1_1.14 XP1_2.11 XP1_2.12 XP1_2.13 XP1_2.14 XP4_1.27 XP4_1.28 XP4_1.29 XP4_1.30 XP4_2.27 XP4_2.28 XP4_2.29 XP4_2.30
5V: C27.2 C30.2 C36.1 CAN1.3(VCC) LDO1.1(INP) LDO2.1(INP) VD1.C XP1_1.7 XP1_1.8 XP1_2.7 XP1_2.8 XP4_1.33 XP4_1.34 XP4_2.33 XP4_2.34
GND: C1.1 C2.1 C3.1 C4.1 C5.1 C7.1 C8.1 C9.1 C10.1 C11.1 C12.1 C13.1 C14.1 C15.1 C16.1 C17.1 C18.1 C19.1 C20.1 C21.1 C22.1 C23.1 C24.1 C25.1 C26.1 C27.1 C28.1 C29.1 C30.1 C31.1 C32.1 C33.1 C34.1 C35.1 C36.2 C37.1 C38.1 CAN1.2(GND) CAN1.8(STB) D.6(VSS) D.S1 D.S2 D1.3(VSS) D1.8(VSS) D1.9(VSS) D2.2(NC) D2.4(GNDA) D2.6(GNDIO) D2.7(PS) D3.A1(PS) D3.C5(GND) D3.E1(GND) D3.E3(GND) D4.6(GNDIO) D4.7(GND) HL3.2(К) HL4.2(К) LDO1.2(GND) LDO1.4(GND) LDO2.2(GND) LDO2.4(GND) P.6 R14.1 R17.2 R25.2 R34.1 R36.2 R37.2 TYPE-C1.1(A1) TYPE-C1.8(A12) TYPE-C1.9(B1) TYPE-C1.16(B12) U1.4(GND) U2.6(GND) U2.7(GND) U3.9(GND) U3.11(GND) U4.16(VSS) U4.38(VSS) U4.51(VSS) U4.61(VSS) U4.83(VSS) U4.94(VSS) U4.107(VSS) U4.120(VSS) U4.130(VSS) XP1_1.37 XP1_1.38 XP1_1.39 XP1_1.40 XP1_2.37 XP1_2.38 XP1_2.39 XP1_2.40 XP2_1.1 XP2_1.2 XP2_1.3 XP2_1.4 XP2_1.5 XP2_1.6 XP2_1.37 XP2_1.38 XP2_1.39 XP2_1.40 XP2_2.1 XP2_2.2 XP2_2.3 XP2_2.4 XP2_2.5 XP2_2.6 XP2_2.37 XP2_2.38 XP2_2.39 XP2_2.40 XP3_1.1 XP3_1.2 XP3_1.3 XP3_1.4 XP3_1.35 XP3_1.36 XP3_1.37 XP3_1.38 XP3_1.39 XP3_1.40 XP3_2.1 XP3_2.2 XP3_2.3 XP3_2.4 XP3_2.35 XP3_2.36 XP3_2.37 XP3_2.38 XP3_2.39 XP3_2.40 XP4_1.1 XP4_1.2 XP4_1.3 XP4_1.4 XP4_2.1 XP4_2.2 XP4_2.3 XP4_2.4
VCC: XP1_1.1 XP1_1.2 XP1_1.3 XP1_1.4 XP1_1.5 XP1_1.6 XP1_2.1 XP1_2.2 XP1_2.3 XP1_2.4 XP1_2.5 XP1_2.6 XP4_1.35 XP4_1.36 XP4_1.37 XP4_1.38 XP4_1.39 XP4_1.40 XP4_2.35 XP4_2.36 XP4_2.37 XP4_2.38 XP4_2.39 XP4_2.40
ADC_0: U4.26(PC0) XP3_1.24 XP3_2.24 ; port ADC_0
ADC_1: U4.27(PC1) XP3_1.26 XP3_2.26 ; port ADC_1
ADC_2: U4.28(PC2) XP3_1.28 XP3_2.28 ; port ADC_2
ADC_3: U4.29(PC3) XP3_1.30 XP3_2.30 ; port ADC_3
ADC_CURR: U4.14(PF4) XP4_1.15 XP4_2.15 ; port ADC_CURR
ADC_VBAT: U4.15(PF5) XP4_1.17 XP4_2.17 ; port ADC_VBAT
AGND: R37.1 U4.31(VSSA) XP3_1.32 XP3_2.32 ; port AGND
BOOT0: R36.1 U4.138(BOOT0) XP2_1.20 XP2_2.20 ; port BOOT0
CAN_RX: CAN1.4(RXD) U4.73(PB12) ; port CAN_RX
CAN_TX: CAN1.1(TXD) U4.74(PB13) ; port CAN_TX
CANH: CAN1.7(CANH) R1.1 XP2_1.24 XP2_2.24 ; port CANH
CANL: CAN1.6(CANL) R2.1 XP2_1.26 XP2_2.26 ; port CANL
DIOD_1: HL1.2(К) U4.8(PC14) ; port DIOD_1
DIOD_2: HL2.2(К) U4.9(PC15) ; port DIOD_2
EXMC_CLK: U1.6(CLK) U4.117(PD3) ; port EXMC_CLK
EXMC_D0: U1.5(DI_(IO0)) U4.85(PD14) ; port EXMC_D0
EXMC_D1: U1.2(DO_(IO1)) U4.86(PD15) ; port EXMC_D1
EXMC_D2: U1.3(WP_(IO2)) U4.114(PD0) ; port EXMC_D2
EXMC_D3: U1.7(HOLD_or_RESET_(IO3)) U4.115(PD1) ; port EXMC_D3
EXMC_NE0: U1.1(CS) U4.123(PD7) ; port EXMC_NE0
GPIO0: U4.141(PE0) XP3_1.6 XP3_2.6 ; port GPIO0
GPIO1: U4.142(PE1) XP3_1.8 XP3_2.8 ; port GPIO1
GPIO2: U4.1(PE2) XP3_1.10 XP3_2.10 ; port GPIO2
GPIO3: U4.2(PE3) XP3_1.12 XP3_2.12 ; port GPIO3
GPIO4: U4.3(PE4) XP3_1.14 XP3_2.14 ; port GPIO4
GPIO5: U4.4(PE5) XP4_1.5 XP4_2.5 ; port GPIO5
GPIO6: U4.5(PE6) XP4_1.7 XP4_2.7 ; port GPIO6
GPIO7: U4.58(PE7) XP4_1.9 XP4_2.9 ; port GPIO7
I2C0_SCL: R7.1 U3.1(SCL) U4.11(PF1) XP3_1.11 XP3_2.11 ; port I2C0_SCL
I2C0_SDA: R6.1 U3.16(SDA) U4.10(PF0) XP3_1.9 XP3_2.9 ; port I2C0_SDA
INT1: D2.16(INT1) U4.93(PG8) ; port INT1
INT2: D2.1(INT2) U4.92(PG7) ; port INT2
INT3: D2.12(INT3) U4.91(PG6) ; port INT3
INT4: D2.13(INT4) U4.90(PG5) ; port INT4
INT5: D3.D2(INT) U4.89(PG4) ; port INT5
INT6: D4.4(INT1) U4.88(PG3) ; port INT6
INT7: U2.4(INT1) U4.127(PG12) ; port INT7
INT8: U2.9(INT2) U4.126(PG11) ; port INT8
INT9: D1.7(INT) U4.125(PG10) ; port INT9
INT10: D4.9(INT2) U4.132(PG15) ; port INT10
JTCK: P.5 R25.1 U4.109(PA14) ; port JTCK
JTD0: P.7 R5.2 R8.1 R11.1 R22.1 R39.1 U4.133(PB3) XP1_1.29 XP1_2.29 ; port SPI0_SCK, port JTD0
JTDI: P.3 R20.1 U4.110(PA15) XP1_1.31 XP1_2.31 ; port SPI0_NSS1, port JTDI
JTMS: P.4 R21.1 U4.105(PA13) ; port JTMS
JTRST: P.2 R19.1 ; port JTRST
MAIN_RXD: U4.129(PG14) XP1_1.34 XP1_2.34 XP4_1.22 XP4_2.22 ; port USART5_RX, port MAIN_RXD
MAIN_TXD: U4.124(PG9) XP1_1.36 XP1_2.36 XP4_1.24 XP4_2.24 ; port USART5_TX, port MAIN_TXD
NSS0: D3.A5(CSB) U4.55(PF15) ; port NSS0
NSS1: U2.12(CS) U4.54(PF14) ; port NSS1
NSS2: D2.14(CSB1) U4.53(PF13) ; port NSS2
NSS3: D2.5(CSB2) U4.50(PF12) ; port NSS3
NSS4: D1.6(CSB) U4.49(PF11) ; port NSS4
NSS5: D4.12(CSB) R38.1 U4.22(PF10) ; port NSS5
RST: P.8 U4.25(NRST) ; port RST
SDIO_CMD: D.3(CMD) U4.42(PA6) ; port SDIO_CMD
SDIO_D0: D.7(DAT0) R29.2 U4.98(PC8) ; port SDIO_D0
SDIO_D1: D.8(DAT1) R30.2 U4.100(PA8) ; port SDIO_D1
SDIO_D2: D.1(DAT2) R31.2 U4.101(PA9) ; port SDIO_D2
SDIO_D3: D.2(CD/DAT3) R32.2 ; port SDIO_D3
SDIO_SCK: D.5(CLK) U4.48(PB2) ; port SDIO_SCK
SPI0_MISO: R3.2 R10.1 R12.2 R24.2 R41.1 U4.134(PB4) XP1_1.25 XP1_2.25 ; port SPI0_MISO
SPI0_MOSI: R4.2 R9.1 R13.1 R23.1 R40.1 U4.135(PB5) XP1_1.27 XP1_2.27 ; port SPI0_MOSI
SPI0_NSS2: U4.40(PA4) XP1_1.33 XP1_2.33 ; port SPI0_NSS2
TIMER0_CH0: U4.60(PE9) XP2_1.7 XP2_2.7 ; port TIMER0_CH0
TIMER0_CH1: U4.64(PE11) XP2_1.9 XP2_2.9 ; port TIMER0_CH1
TIMER0_CH2: U4.66(PE13) XP2_1.11 XP2_2.11 ; port TIMER0_CH2
TIMER0_CH3: U4.67(PE14) XP2_1.13 XP2_2.13 ; port TIMER0_CH3
TIMER1_CH0: U4.139(PB8) XP2_1.15 XP2_2.15 ; port TIMER1_CH0
TIMER2_CH0: U4.35(PA1) XP2_1.25 XP2_2.25 ; port TIMER2_CH0
TIMER2_CH1: U4.43(PA7) XP2_1.27 XP2_2.27 ; port TIMER2_CH1
TIMER3_CH0: U4.81(PD12) XP2_1.29 XP2_2.29 ; port TIMER3_CH0
TIMER3_CH1: U4.82(PD13) XP2_1.31 XP2_2.31 ; port TIMER3_CH1
TIMER7_CH0: U4.41(PA5) XP2_1.17 XP2_2.17 ; port TIMER7_CH0
TIMER7_CH1: U4.46(PB0) XP2_1.19 XP2_2.19 ; port TIMER7_CH1
TIMER7_CH2: U4.47(PB1) XP2_1.21 XP2_2.21 ; port TIMER7_CH2
TIMER7_CH3: U4.99(PC9) XP2_1.23 XP2_2.23 ; port TIMER7_CH3
UART3_RX: U4.111(PC10) XP3_1.23 XP3_2.23 ; port UART3_RX
UART3_TX: U4.112(PC11) XP3_1.25 XP3_2.25 ; port UART3_TX
UART4_RX: U4.116(PD2) XP2_1.28 XP2_2.28 ; port UART4_RX
UART4_TX: U4.113(PC12) XP2_1.30 XP2_2.30 ; port UART4_TX
USART0_RX: U4.137(PB7) XP3_1.27 XP3_2.27 ; port USART0_RX
USART0_TX: U4.136(PB6) XP3_1.29 XP3_2.29 ; port USART0_TX
USART1_RX: U4.37(PA3) XP1_1.17 XP1_2.17 ; port USART1_RX
USART1_TX: U4.36(PA2) XP1_1.19 XP1_2.19 ; port USART1_TX
USART2_CTS: U4.45(PC5) XP4_1.14 XP4_2.14 ; port USART2_CTS
USART2_RTS: U4.75(PB14) XP4_1.16 XP4_2.16 ; port USART2_RTS
USART2_RX: U4.70(PB11) XP4_1.10 XP4_2.10 ; port USART2_RX
USART2_TX: U4.69(PB10) XP4_1.12 XP4_2.12 ; port USART2_TX
USBFS_DM: R16.2 U4.103(PA11) ; port USBFS_DM
USBFS_DP: R15.2 U4.104(PA12) ; port USBFS_DP
WKUP: R28.1 R34.2 U4.34(PA0) ; port WKUP
NetC1_2: C1.2 CAN1.5(SPLIT) R1.2 R2.2
NetC5_2: C5.2 U3.10(C1)
NetC6_1: C6.1 U3.12(SETC)
NetC6_2: C6.2 U3.8(STEP)
NetC7_2: C7.2 U4.24(PH1) Y1.2
NetC8_2: C8.2 U4.23(PH0) Y1.1
NetC26_2: C26.2 R18.2 U4.32(VREFP)
NetC34_2: C34.2 D4.5(VDDIO) R42.1
NetC35_2: C35.2 D4.8(VDD)
NetD1_2: D1.2(SCK) R8.2
NetD1_4: D1.4(SDI) R9.2
NetD1_5: D1.5(SDO) R10.2
NetD2_8: D2.8(SCL/SCK) R11.2
NetD2_9: D2.9(SDA/SDI) R13.2
NetD2_10: D2.10(SDO2) D2.15(SDO1) R12.1
NetD3_A3: D3.A3(SCK) R22.2
NetD3_B4: D3.B4(SDI) R23.2
NetD3_C1: D3.C1(SDO) R24.1
NetD4_1: D4.1(SDO) R41.2
NetD4_13: D4.13(SCX) R39.2
NetD4_14: D4.14(SDX) R40.2
NetHL1_1: HL1.1(А) R26.1
NetHL2_1: HL2.1(А) R27.1
NetHL3_1: HL3.1(А) R33.1
NetHL4_1: HL4.1(А) R35.1
NetR3_1: R3.1 U2.1(SDO/SA0)
NetR4_1: R4.1 U2.14(SDA)
NetR5_1: R5.1 U2.13(SCL)
NetR14_2: R14.2 TYPE-C1.3(A5)
NetR15_1: R15.1 TYPE-C1.4(A6) TYPE-C1.12(B6)
NetR16_1: R16.1 TYPE-C1.5(A7) TYPE-C1.13(B7)
NetR17_1: R17.1 TYPE-C1.11(B5)
NetTYPE-C1_2: TYPE-C1.2(A4) TYPE-C1.7(A9) TYPE-C1.10(B4) TYPE-C1.15(B9) VD1.A

Not connected (* = marked no-connect by the designer): D 9(CD); D3 D4(DRDY); D4 2(ASDx) 3(ASCx) 10(OCSB) 11(OSDO); TYPE-C1 6(A8) 14(B8); U2 2(SDx) 3(SCx) 10(RESV-NC) 11(RESV-NC); U3 3(NC) 5(NC) 6(NC) 7(NC) 14(NC) 15(DRDY); U4 7(PC13) 12(PF2) 13(PF3) 18(PF6) 19(PF7) 20(PF8) 21(PF9) 44(PC4) 56(PG0) 57(PG1) 59(PE8) 63(PE10) 65(PE12) 68(PE15) 71(NC_) 76(PB15) 77(PD8) 78(PD9) 79(PD10) 80(PD11) 87(PG2) 96(PC6) 97(PC7) 102(PA10) 106(NC) 118(PD4) 119(PD5) 122(PD6) 128(PG13) 140(PB9) 143(PDR_ON); XP1_1 15 16 18 20 21 22 23 24 26 28 30 32 35; XP1_2 15 16 18 20 21 22 23 24 26 28 30 32 35; XP2_1 8 10 12 14 16 18 22 32 33 34 35 36; XP2_2 8 10 12 14 16 18 22 32 33 34 35 36; XP3_1 5 7 13 15 16 17 18 19 20 21 22 31 33 34; XP3_2 5 7 13 15 16 17 18 19 20 21 22 31 33 34; XP4_1 6 8 11 13 18 19 20 21 23 25 26; XP4_2 6 8 11 13 18 19 20 21 23 25 26

## Notes on the sheet
- (near XP1_1) VCC
- (near XP2_1) GND
- (near XP1_1) 5V
- (near XP1_1) 3V3
- (near XP2_1) TIMER0_0
- (near XP2_1) TIMER0_1
- (near XP2_1) ENET_AVDDD
- (near XP2_1) ENET_RX+
- (near XP1_1) 4V2
- (near XP2_1) TIMER0_2
- (near XP2_1) TIMER0_3
- (near XP2_1) TIMER1_0
- (near XP2_1) ENET_RX-
- (near XP2_1) ENET_TX+
- (near XP2_1) ENET_TX-
- (near XP1_1) USART1_RX
- (near XP1_1) USART1_TX
- (near XP2_1) TIMER7_0
- (near XP2_1) TIMER7_1
- (near XP2_1) TIMER7_2
- (near XP2_1) ENET_AGND
- (near XP1_1) SPI0_MISO
- (near XP1_1) SPI0_MOSI
- (near XP2_1) TIMER7_3
- (near XP2_1) TIMER2_0
- (near XP2_1) TIMER2_1
- (near XP2_1) UART4_RX
- (near XP2_1) CAN_H
- (near XP2_1) CAN_L
- (near XP1_1) SPI0_NSS2
- (near XP1_1) SPI0_SCK
- (near XP1_1) SPI0_NSS1
- (near XP1_1) MAIN_RX
- (near XP1_1) DBG_RX
- (near XP1_1) DBG_TX
- (near XP2_1) TIMER3_0
- (near XP2_1) TIMER3_1
- (near XP2_1) UART4_TX
- (near XP1_1) GND
- (near XP1_1) MAIN_TX
- (near XP3_1) GND
- (near XP3_1) GPIO_0
- (near XP4_1) GPIO_5
- (near XP4_1) GPIO_6
- (near XP4_1) GND
- (near XP3_1) I2C2_SCL
- (near XP3_1) I2C2_SDA
- (near XP3_1) GPIO_1
- (near XP3_1) GPIO_2
- (near XP3_1) GPIO_3
- (near XP3_1) GPIO_4
- (near XP4_1) GPIO_7
- (near XP4_1) GPIO_8
- (near XP4_1) GPIO_9
- (near XP4_1) USART2_CTS
- (near XP4_1) USART2_TX
- (near XP4_1) USART2_RX
- (near XP4_1) ADC_CURR
- (near XP4_1) ADC_VBAT
- (near XP4_1) USART2_RTS
- (near XP3_1) UART3_RX
- (near XP3_1) UART3_TX
- (near XP3_1) ADC_0
- (near XP3_1) ADC_1
- (near XP4_1) USART5_RX
- (near XP4_1) USART5_TX
- (near XP3_1) USART0_TX
- (near XP3_1) USART0_RX
- (near XP3_1) ADC_2
- (near XP3_1) ADC_3
- (near XP3_1) AGND
- (near XP4_1) 3V3
- (near XP4_1) 4V2
- (near XP4_1) 5V
- (near XP4_1) VCC
- (near XP1_2) VCC
- (near XP2_2) GND
- (near XP1_2) 5V
- (near XP2_2) TIMER0_0
- (near XP2_2) ENET_AVDDD
- (near XP1_2) 3V3
- (near XP1_2) 4V2
- (near XP2_2) TIMER0_1
- (near XP2_2) TIMER0_2
- (near XP2_2) TIMER0_3
- (near XP2_2) ENET_RX-
- (near XP2_2) ENET_RX+
- (near XP2_2) ENET_TX+
- (near XP1_2) USART1_RX
- (near XP1_2) USART1_TX
- (near XP2_2) TIMER1_0
- (near XP2_2) TIMER7_0
- (near XP2_2) TIMER7_1
- (near XP2_2) TIMER7_2
- (near XP2_2) ENET_AGND
- (near XP2_2) ENET_TX-
- (near XP1_2) SPI0_MISO
- (near XP1_2) SPI0_MOSI
- (near XP2_2) TIMER7_3
- (near XP2_2) TIMER2_0
- (near XP2_2) TIMER2_1
- (near XP2_2) UART4_RX
- (near XP2_2) CAN_H
- (near XP2_2) CAN_L
- (near XP1_2) SPI0_NSS2
- (near XP1_2) SPI0_SCK
- (near XP1_2) SPI0_NSS1
- (near XP1_2) MAIN_RX
- (near XP1_2) DBG_RX
- (near XP1_2) DBG_TX
- (near XP2_2) TIMER3_0
- (near XP2_2) TIMER3_1
- (near XP2_2) UART4_TX
- (near XP1_2) GND
- (near XP1_2) MAIN_TX
- (near XP3_2) GND
- (near XP3_2) GPIO_0
- (near XP4_2) GPIO_5
- (near XP4_2) GND
- (near XP3_2) I2C2_SCL
- (near XP3_2) I2C2_SDA
- (near XP3_2) GPIO_1
- (near XP3_2) GPIO_2
- (near XP3_2) GPIO_3
- (near XP4_2) GPIO_6
- (near XP4_2) GPIO_7
- (near XP4_2) GPIO_8
- (near XP4_2) USART2_TX
- (near XP4_2) USART2_RX
- (near XP3_2) GPIO_4
- (near XP4_2) GPIO_9
- (near XP4_2) ADC_CURR
- (near XP4_2) ADC_VBAT
- (near XP4_2) USART2_CTS
- (near XP4_2) USART2_RTS
- (near XP3_2) UART3_RX
- (near XP3_2) UART3_TX
- (near XP3_2) ADC_0
- (near XP3_2) ADC_1
- (near XP4_2) USART5_RX
- (near XP4_2) USART5_TX
- (near XP3_2) USART0_TX
- (near XP3_2) USART0_RX
- (near XP3_2) ADC_2
- (near XP3_2) ADC_3
- (near XP3_2) AGND
- (near XP4_2) 3V3
- (near XP4_2) 4V2
- (near XP4_2) 5V
- (near XP4_2) VCC
- (in symbol Header 1x8) Назначение
- (in symbol PLLD-1.27-40S) Назначение
- (in symbol TYPE-C-31-M-12) Назначение; GND; VBUS; CC1; DP1; DN1; SBU1; CC2; DP2; DN2; SBU2

## Library data of the parts
C1-C38 = Capacitor: Type: Конденсатор; Published: 18.05.2010; Publisher: Andrew Danich
D = GTFP08131Y2HR
HL1-HL4 = Led-1: Type: Индикатор единичный; Published: 03.12.2013; Publisher: Andrew Danich
R1-R42 = Resistor: Published: 24.03.2010; Publisher: Andrew Danich; Type: Резистор
VD1 = Schottky
Y1 = ABM7-8.000MHZ-8-R80-D2Y-T: Crystal 22.1184MHz Ã‚Â±20ppm (Tol) Ã‚Â±30ppm (Stability) 18pF FUND 50Ohm 2-Pin Mini-CSMD T/R; Package: None; Price: None; Value: *; MP: ABM7-8.000MHZ-8-R80-D2Y-T; Availability: Unavailable